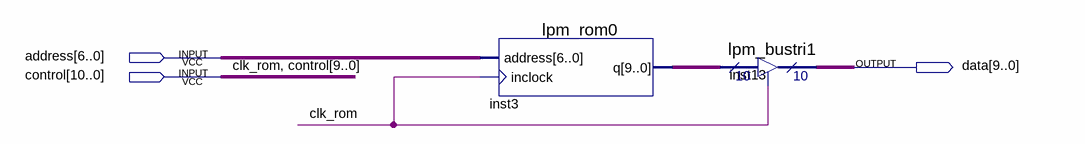
[diagram p0: schematic sheet]
// Quartus schematic rom.bdf as structural Verilog: 2 symbols, 3 pins
module rom (
  input  [6:0] address,
  input  [10:0] control,
  output [9:0] data
);

  wire [9:0] inst3_q;

  lpm_rom0 inst3 (.address(address), .inclock(control[10]), .q(inst3_q));
  lpm_bustri1 inst13 (.enabledt(control[10]), .data(inst3_q), .tridata(data));

  // Other names for the same wires on the sheet: clk_rom = control[10]
endmodule
